# EAGLE design x-IMU RGB LEDs (EAGLE 5.10)
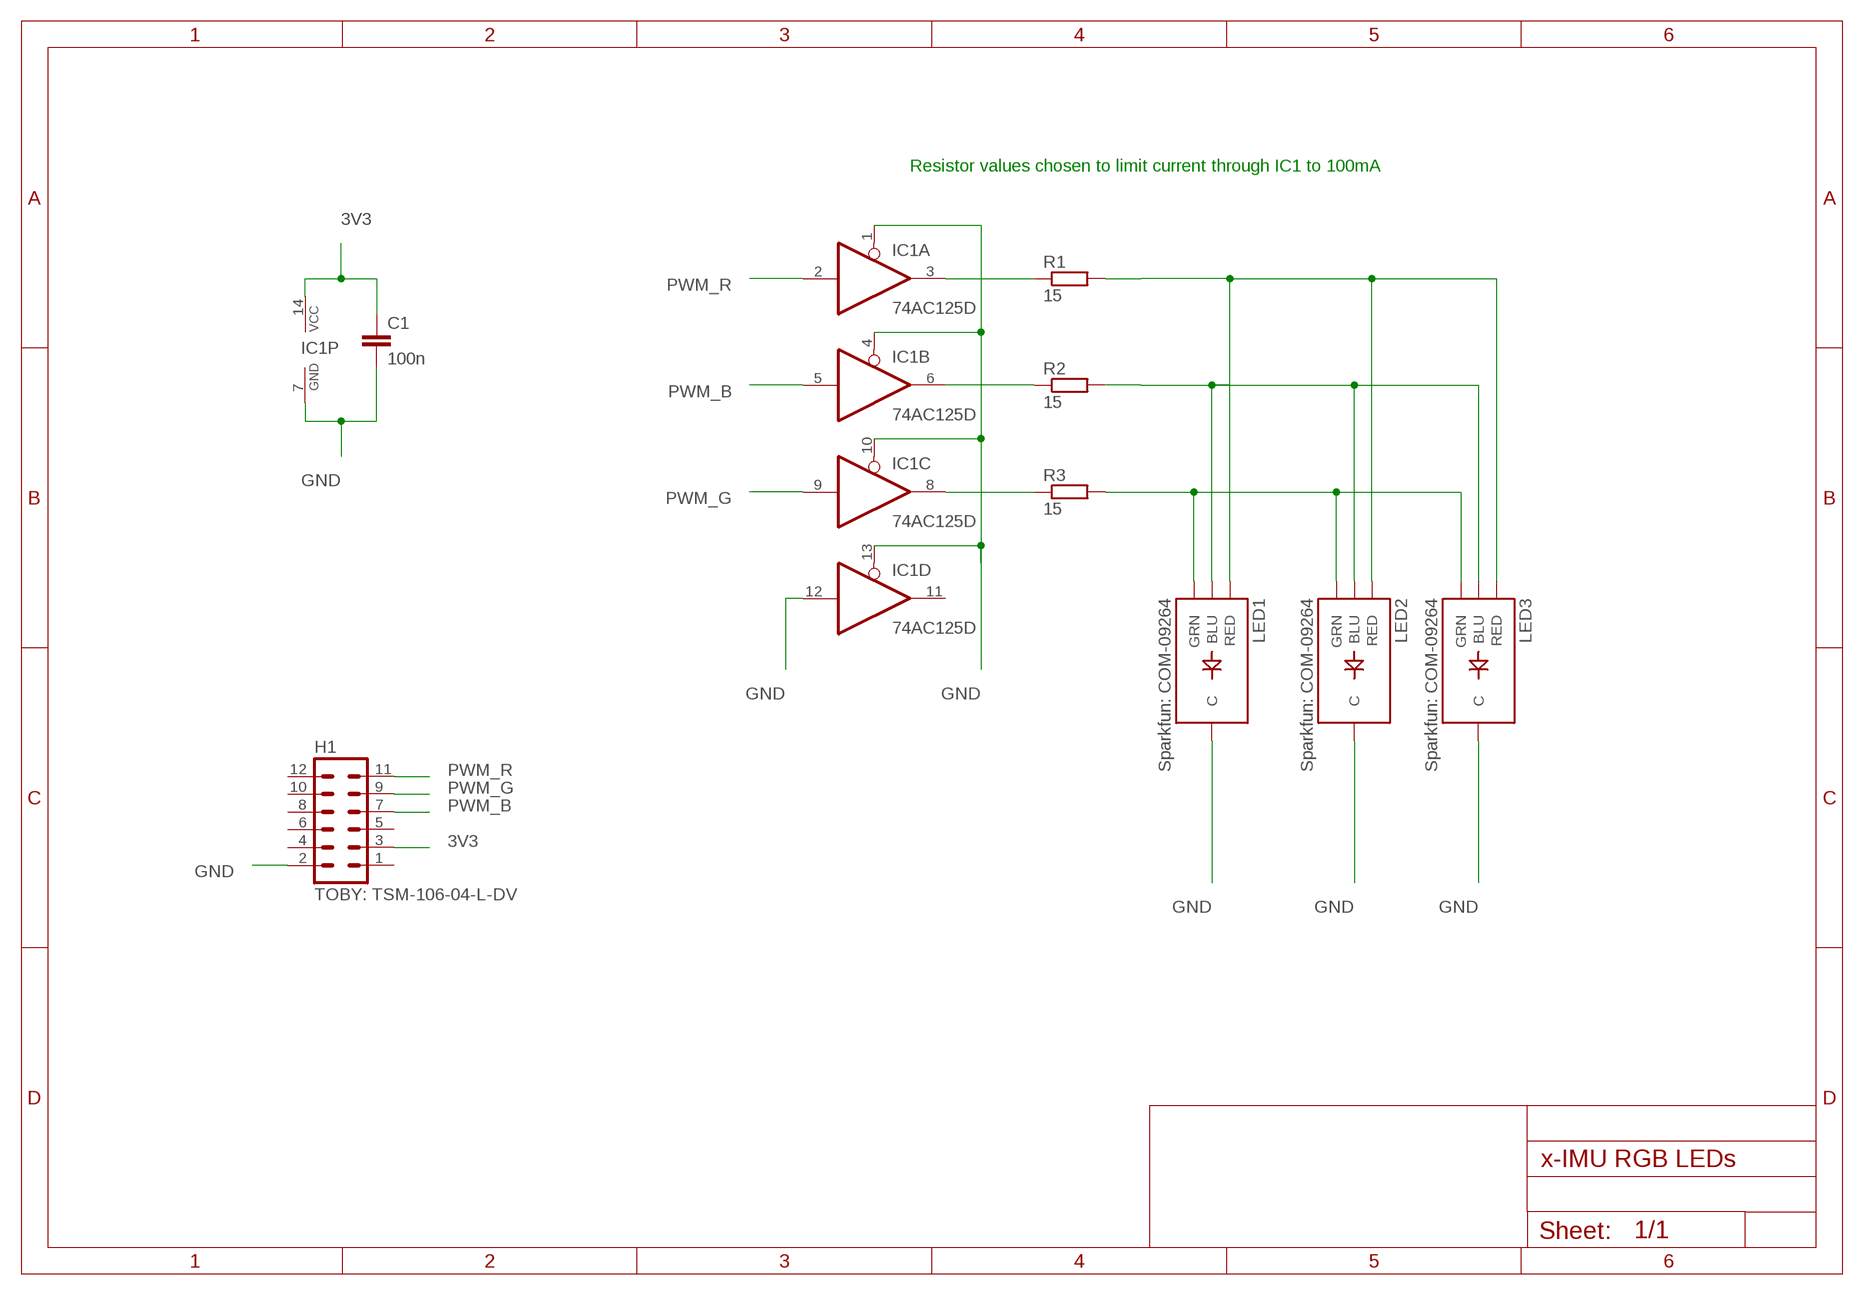
[diagram p0: schematic, sheet 1]

## Parts
C1  100n  C-EUC0603  [C0603]
H1  TOBY: TSM-106-04-L-DV  MA06-2_SMT  [MA06-2_SMT]
IC1  74AC125D  [SO14]
LED1  Sparkfun: COM-09264  LED-TRICOLOR-THROUGHHOLE  [LED-TRICOLOR-THROUGHHOLE]
LED2  Sparkfun: COM-09264  LED-TRICOLOR-THROUGHHOLE  [LED-TRICOLOR-THROUGHHOLE]
LED3  Sparkfun: COM-09264  LED-TRICOLOR-THROUGHHOLE  [LED-TRICOLOR-THROUGHHOLE]
R1  15  R-EU_R0603  [R0603]
R2  15  R-EU_R0603  [R0603]
R3  15  R-EU_R0603  [R0603]

## Nets
3V3: C1.1 H1.3 IC1.14(P:VCC)
GND: C1.2 H1.2 IC1.1(A:OE) IC1.4(B:OE) IC1.7(P:GND) IC1.10(C:OE) IC1.12(D:I) IC1.13(D:OE) LED1.GND(C) LED2.GND(C) LED3.GND(C)
N$1: IC1.6(B:O) R2.1
N$2: LED1.GRN LED2.GRN LED3.GRN R3.2
N$4: IC1.8(C:O) R3.1
N$5: IC1.3(A:O) R1.1
N$7: LED1.RED LED2.RED LED3.RED R1.2
PWM_B: H1.7 IC1.5(B:I)
PWM_G: H1.9 IC1.9(C:I)
PWM_R: H1.11 IC1.2(A:I)
R": LED1.BLU LED2.BLU LED3.BLU R2.2
Unconnected: H1.1 H1.4 H1.5 H1.6 H1.8 H1.10 H1.12 IC1.11(D:O)

## Notes on the sheet
- Resistor values chosen to limit current through IC1 to 100mA

## Library data of the parts
C1 = rcl:C-EU: CAPACITOR, European symbol
H1 = con-lstbMODIFIED:MA06-2_SMT
IC1 = 74xx-eu:74*125: Quad bus BUFFER, 3-state
LED1-LED3 = SparkFun_08_2011:LED-TRICOLOR-THROUGHHOLE
R1-R3 = rcl:R-EU_: RESISTOR, European symbol

## Board
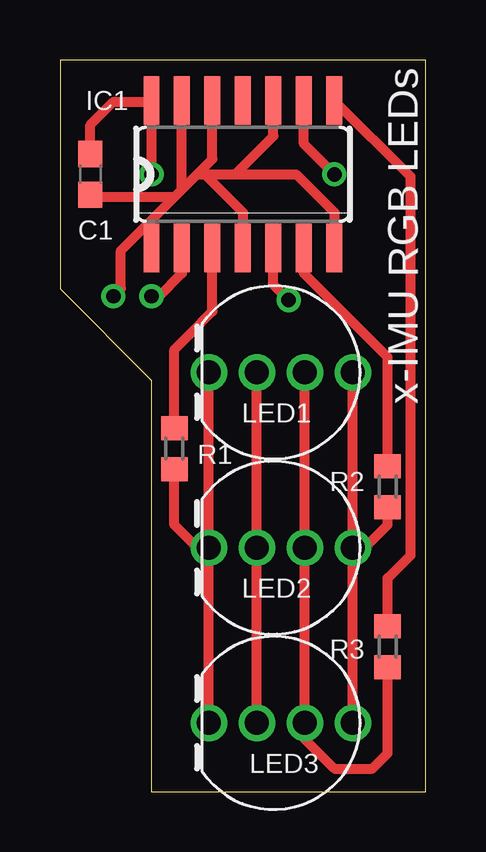
[diagram p1: board, top side]
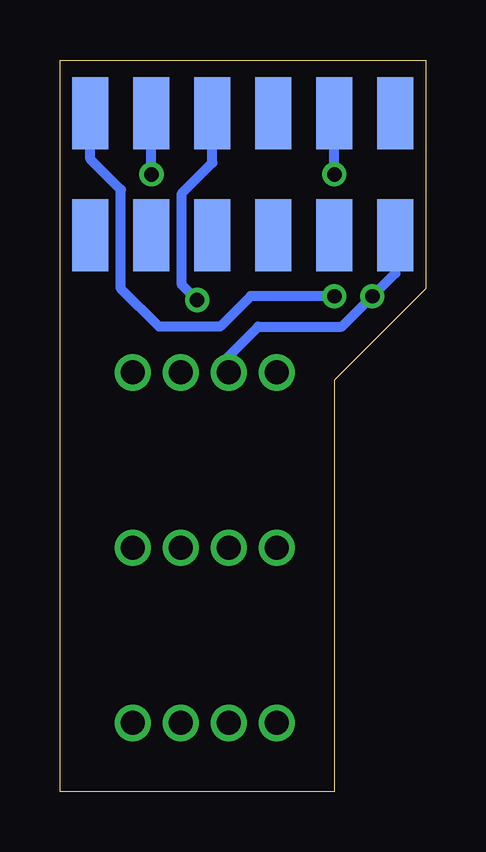
[diagram p2: board, bottom side, seen from below]

Size 15.24 x 30.48 mm. Coordinates in mm from the lower left corner, seen from the top.
Outline: 15.24,0 15.24,30.48 0,30.48 0,20.95 3.81,17.14 3.81,0 15.24,0
Copper layers (1*16): Top 0.035mm / dielectric 1.5mm / Bottom 0.035mm
Design rules "default *": minimum track width 0.15mm, minimum drill 0.3mm, track to track 0.15mm, track to pad 0.15mm, pad to pad 0.15mm, via to via 0.15mm, smd to smd 0.15mm, copper to edge 0.2mm, drill to drill 0.15mm, minimum pad ring 10mil, minimum via ring 8mil, stop-mask expansion 4mil, vias tented up to drill 1mm, thermal gap 10mil

### Footprints (pad centres in the part's own frame; a part is rotated, then mirrored left to right if it is on the bottom)
C0603 = smd 1.1 x 1: 1 -0.85,0; 2 0.85,0
MA06-2_SMT = smd 1.5 x 3: 1 6.35,2.54; 2 6.35,-2.54; 3 3.81,2.54; 4 3.81,-2.54; 5 1.27,2.54; 6 1.27,-2.54; 7 -1.27,2.54; 8 -1.27,-2.54; 9 -3.81,2.54; 10 -3.81,-2.54; 11 -6.35,2.54; 12 -6.35,-2.54
SO14 = smd 0.66 x 2.032: 1 -3.81,-3.073; 2 -2.54,-3.073; 3 -1.27,-3.073; 4 0,-3.073; 5 1.27,-3.073; 6 2.54,-3.073; 7 3.81,-3.073; 8 3.81,3.073; 9 2.54,3.073; 10 1.27,3.073; 11 0,3.073; 12 -1.27,3.073; 13 -2.54,3.073; 14 -3.81,3.073
LED-TRICOLOR-THROUGHHOLE = drill 1 round: BLU 3,0; GND -1,0; GRN 1,0; RED -3,0
R0603 = smd 1 x 1.1: 1 -0.85,0; 2 0.85,0

### Placement (x,y rotation side)
C1  1.27,25.72 270 top
H1  7.62,25.72 0 bottom
IC1  7.62,25.72 0 top
LED1  9.21,17.46 0 top
LED2  9.21,10.16 0 top
LED3  9.21,2.86 0 top
R1  4.76,14.29 270 top
R2  13.65,12.7 270 top
R3  13.65,6.03 270 top

### Tracks (layer width: path | path; a pad name or v marks a point on that pad's centre or on a via)
3V3  (via drill 0.6)
  Top 0.406: v3.81,25.72 IC1.14 3.75,28.73 2.22,28.73 1.27,27.78 C1.1
  Bottom 0.406: v3.81,25.72 H1.3
GND  (via drill 0.6)
  Top 0.406: LED1.GND LED2.GND LED3.GND | C1.2 1.27,24.77 4.76,24.77 | 4.76,24.77 3.81,23.81 3.49,23.5 | 4.76,24.77 5.08,25.08 | 5.08,25.08 5.4,25.4 5.71,25.72 6.03,25.72 | 6.03,25.72 6.35,25.72 6.67,25.72 6.99,25.72 7.3,25.72 | 7.3,25.72 8.57,25.72 9.84,25.72 11.43,24.13 IC1.7 | 5.08,25.08 IC1.13 5.08,25.08 | 4.76,24.77 5.08,25.08 | 5.08,25.08 6.35,26.35 IC1.12 | IC1.10 8.89,27.3 7.3,25.72 | IC1.4 7.62,24.13 6.03,25.72 | 3.49,23.5 2.54,22.54 2.54,20.95 v2.22,20.64 | IC1.1 3.81,23.5 3.49,23.5 | 4.76,24.77 5.08,25.08
  Bottom 0.406: LED1.GND 8.21,18.14 7.94,18.41 6.99,19.37 3.49,19.37 v2.22,20.64 1.27,21.59 H1.2
N$1
  Top 0.406: R2.1 13.65,18.1 10.16,21.59 IC1.6
N$2
  Top 0.406: LED1.GRN LED2.GRN LED3.GRN 10.21,2.17 11.43,0.95 13.02,0.95 13.65,1.59 R3.2
N$4
  Top 0.406: R3.1 13.65,8.89 14.61,9.84 14.61,25.62 IC1.8
N$5
  Top 0.406: R1.1 4.76,18.41 5.4,19.05 6.35,20 IC1.3
N$7
  Top 0.406: LED3.RED LED2.RED | LED2.RED LED1.RED | LED2.RED 5.71,10.16 4.76,11.11 R1.2
PWM_B  (via drill 0.6)
  Top 0.406: v9.53,20.48 8.89,21.11 IC1.5
  Bottom 0.406: H1.7 8.89,26.19 10.16,24.92 10.16,21.11 v9.53,20.48
PWM_G  (via drill 0.6)
  Top 0.406: IC1.9 10.16,26.99 v11.43,25.72
  Bottom 0.406: v11.43,25.72 H1.9
PWM_R  (via drill 0.6)
  Top 0.406: v3.81,20.64 4.13,20.64 5.08,21.59 IC1.2
  Bottom 0.406: H1.11 13.97,26.35 12.7,25.08 12.7,20.95 11.11,19.37 8.57,19.37 7.3,20.64 v3.81,20.64
R"
  Top 0.406: LED3.BLU LED2.BLU | LED2.BLU LED1.BLU | LED2.BLU 12.7,10.16 13.65,11.11 R2.2

### Text on the board
_tsilk: x-IMU RGB LEDs